# Altium schematic sheet Vezerlo.SchDoc: LED Matrix
size A4; Author: Bencsik Dániel Zoltán; Organization: BME-AUT; DocumentNumber: 3; Revision: A7; SheetNumber: 3; SheetTotal: 4
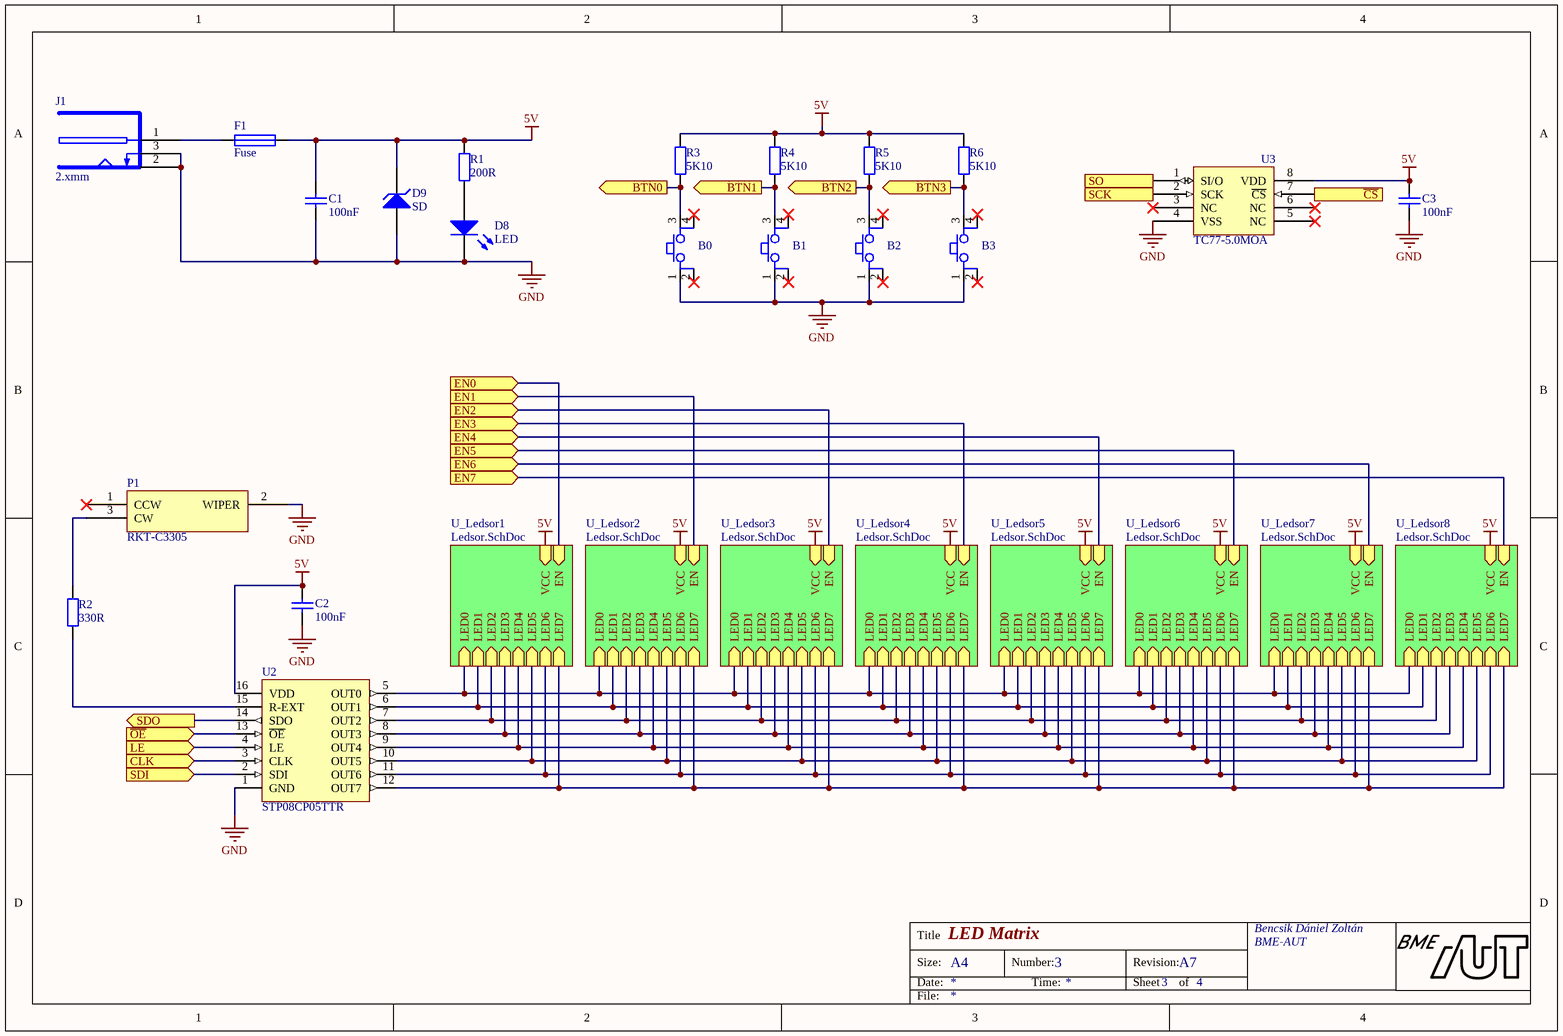
[diagram p0: Vezerlo.SchDoc]

## Parts
B0  Button  [FP_BTN_SMD]  (value not drawn)
B1  Button  [FP_BTN_SMD]  (value not drawn)
B2  Button  [FP_BTN_SMD]  (value not drawn)
B3  Button  [FP_BTN_SMD]  (value not drawn)
C1  100nF  [FP_0603_CAP_080]
C2  100nF  [FP_0603_CAP_080]
C3  100nF  [FP_0603_CAP_080]
D8  LED  [HF_FP_0805_LED_BLUE&RED_2]
D9  SD  [FP_SMA]
F1  Fuse  [FP_MULTIFUSE]
J1  2.xmm  [FP_DC_TAP_ANYA]
P1  RKT-C3305  [HF_POT]
R1  200R  [HF_FP_0603_RES]
R2  330R  [HF_FP_0603_RES]
R3  5K10  [HF_FP_0603_RES]
R4  5K10  [HF_FP_0603_RES]
R5  5K10  [HF_FP_0603_RES]
R6  5K10  [HF_FP_0603_RES]
U2  STP08CP05TTR  [TSOP65P640X120-16M]
U3  TC77-5.0MOA  [HF_SOIC127P599X175-8N]

## Sub-sheets
U_Ledsor1 = Ledsor.SchDoc: LED0 (in), LED1 (in), LED2 (in), LED3 (in), LED4 (in), LED5 (in), LED6 (in), LED7 (in), EN (in), VCC (in)
U_Ledsor2 = Ledsor.SchDoc: LED0 (in), LED1 (in), LED2 (in), LED3 (in), LED4 (in), LED5 (in), LED6 (in), LED7 (in), EN (in), VCC (in)
U_Ledsor3 = Ledsor.SchDoc: LED0 (in), LED1 (in), LED2 (in), LED3 (in), LED4 (in), LED5 (in), LED6 (in), LED7 (in), EN (in), VCC (in)
U_Ledsor4 = Ledsor.SchDoc: LED0 (in), LED1 (in), LED2 (in), LED3 (in), LED4 (in), LED5 (in), LED6 (in), LED7 (in), EN (in), VCC (in)
U_Ledsor5 = Ledsor.SchDoc: LED0 (in), LED1 (in), LED2 (in), LED3 (in), LED4 (in), LED5 (in), LED6 (in), LED7 (in), EN (in), VCC (in)
U_Ledsor6 = Ledsor.SchDoc: LED0 (in), LED1 (in), LED2 (in), LED3 (in), LED4 (in), LED5 (in), LED6 (in), LED7 (in), EN (in), VCC (in)
U_Ledsor7 = Ledsor.SchDoc: LED0 (in), LED1 (in), LED2 (in), LED3 (in), LED4 (in), LED5 (in), LED6 (in), LED7 (in), EN (in), VCC (in)
U_Ledsor8 = Ledsor.SchDoc: LED0 (in), LED1 (in), LED2 (in), LED3 (in), LED4 (in), LED5 (in), LED6 (in), LED7 (in), EN (in), VCC (in)

## Ports
BTN0 (out), BTN1 (out), BTN2 (out), BTN3 (out), CLK (in), EN0 (in), EN1 (in), EN2 (in), EN3 (in), EN4 (in), EN5 (in), EN6 (in), EN7 (in), LE (in), SCK (in), SDI (in), SDO (out), SO (out), ~{CS} (in), ~{OE} (in)

## Nets
5V: C1.2 C2.2 C3.2 D9.K F1.2 R1.2 R3.2 R4.2 R5.2 R6.2 U2.16(VDD) U3.8(VDD) ; sheet U_Ledsor1/VCC, sheet U_Ledsor2/VCC, sheet U_Ledsor3/VCC, sheet U_Ledsor4/VCC, sheet U_Ledsor5/VCC, sheet U_Ledsor6/VCC, sheet U_Ledsor7/VCC, sheet U_Ledsor8/VCC
GND: B0.1 B1.1 B2.1 B3.1 C1.1 C2.1 C3.1 D8.K D9.A J1.2(SLEEVE) J1.3(BREAK) P1.2(WIPER) U2.1(GND) U3.4(VSS)
BTN0: B0.3 R3.1 ; port BTN0
BTN1: B1.3 R4.1 ; port BTN1
BTN2: B2.3 R5.1 ; port BTN2
BTN3: B3.3 R6.1 ; port BTN3
~{CS}: U3.7(~{CS}) ; port ~{CS}
CLK: U2.3(CLK) ; port CLK
EN0: port EN0, sheet U_Ledsor1/EN
EN1: port EN1, sheet U_Ledsor2/EN
EN2: port EN2, sheet U_Ledsor3/EN
EN3: port EN3, sheet U_Ledsor4/EN
EN4: port EN4, sheet U_Ledsor5/EN
EN5: port EN5, sheet U_Ledsor6/EN
EN6: port EN6, sheet U_Ledsor7/EN
EN7: port EN7, sheet U_Ledsor8/EN
LE: U2.4(LE) ; port LE
~{OE}: U2.13(~{OE}) ; port ~{OE}
SCK: U3.2(SCK) ; port SCK
SDI: U2.2(SDI) ; port SDI
SDO: U2.14(SDO) ; port SDO
SO: U3.1(SI/O) ; port SO
NetD8_A: D8.A R1.1
NetF1_1: F1.1 J1.1(PIN)
NetP1_3: P1.3(CW) R2.2
NetR2_1: R2.1 U2.15(R-EXT)
NetU2_5: U2.5(OUT0) ; sheet U_Ledsor1/LED0, sheet U_Ledsor2/LED0, sheet U_Ledsor3/LED0, sheet U_Ledsor4/LED0, sheet U_Ledsor5/LED0, sheet U_Ledsor6/LED0, sheet U_Ledsor7/LED0, sheet U_Ledsor8/LED0
NetU2_6: U2.6(OUT1) ; sheet U_Ledsor1/LED1, sheet U_Ledsor2/LED1, sheet U_Ledsor3/LED1, sheet U_Ledsor4/LED1, sheet U_Ledsor5/LED1, sheet U_Ledsor6/LED1, sheet U_Ledsor7/LED1, sheet U_Ledsor8/LED1
NetU2_7: U2.7(OUT2) ; sheet U_Ledsor1/LED2, sheet U_Ledsor2/LED2, sheet U_Ledsor3/LED2, sheet U_Ledsor4/LED2, sheet U_Ledsor5/LED2, sheet U_Ledsor6/LED2, sheet U_Ledsor7/LED2, sheet U_Ledsor8/LED2
NetU2_8: U2.8(OUT3) ; sheet U_Ledsor1/LED3, sheet U_Ledsor2/LED3, sheet U_Ledsor3/LED3, sheet U_Ledsor4/LED3, sheet U_Ledsor5/LED3, sheet U_Ledsor6/LED3, sheet U_Ledsor7/LED3, sheet U_Ledsor8/LED3
NetU2_9: U2.9(OUT4) ; sheet U_Ledsor1/LED4, sheet U_Ledsor2/LED4, sheet U_Ledsor3/LED4, sheet U_Ledsor4/LED4, sheet U_Ledsor5/LED4, sheet U_Ledsor6/LED4, sheet U_Ledsor7/LED4, sheet U_Ledsor8/LED4
NetU2_10: U2.10(OUT5) ; sheet U_Ledsor1/LED5, sheet U_Ledsor2/LED5, sheet U_Ledsor3/LED5, sheet U_Ledsor4/LED5, sheet U_Ledsor5/LED5, sheet U_Ledsor6/LED5, sheet U_Ledsor7/LED5, sheet U_Ledsor8/LED5
NetU2_11: U2.11(OUT6) ; sheet U_Ledsor1/LED6, sheet U_Ledsor2/LED6, sheet U_Ledsor3/LED6, sheet U_Ledsor4/LED6, sheet U_Ledsor5/LED6, sheet U_Ledsor6/LED6, sheet U_Ledsor7/LED6, sheet U_Ledsor8/LED6
NetU2_12: U2.12(OUT7) ; sheet U_Ledsor1/LED7, sheet U_Ledsor2/LED7, sheet U_Ledsor3/LED7, sheet U_Ledsor4/LED7, sheet U_Ledsor5/LED7, sheet U_Ledsor6/LED7, sheet U_Ledsor7/LED7, sheet U_Ledsor8/LED7

Not connected (* = marked no-connect by the designer): B0 2* 4*; B1 2* 4*; B2 2* 4*; B3 2* 4*; P1 1(CCW)*; U3 3(NC)* 5(NC)* 6(NC)*

## Notes on the sheet
- Title
- Size:
- Date:
- A4
- Number:
- Time:
- Revision:
- Sheet
- of
- File:

## Library data of the parts
B0-B3 = Button 4P: Push button; Name: TACT 6x 6 4P SPST 2 FSM4JSMA (TYC) 50mA 12VDC SMD H=5mm 160g BLACK B. 4-1437565-1; Reference: 45-05-43; Supplier: Lomex
C1-C3 = CAP: Capacitor; Name: 100nF 0603 10% 50V X7R CC0603KPX7R9BB104 (YAG); Supplier: Lomex; Reference: 82-12-71; Value: 100nF
D8 = LED: Typical RED GaAs LED; Name: 2012 RED 631nm 80mcd FYLS-0805URC (FYL) W.CLEAR 2x1.2x0.8mm 0805 130°; Supplier: Lomex; Reference: 95-02-74
D9 = ZENER: Zener Diode; U_Z: 24; Reference: 1815679; Name: SMAJ5.0A-E3/5A; Supplier: Farnell
F1 = Fuse: Name: 1.25A 15V 1812L125/16DR POLYFUSE SMD 1812 (LFS) ˝LF125-16˝; Reference: 44-04-71; Supplier: Lomex
J1 = DC_TAP_ANYA: 2.xmm DC HEBA25 TÁPFESZÜLTSÉG ALJZAT ZÁRT, NYÁKBA 90°; Name: TÁP DC ANYA 5.5/2.1/9.5mm DCS-5521-5; Supplier: Lomex; Reference: 43-07-67
P1 = RKT-C3305: TRIMMER POTENTIOMETER-3mm SMD; Name: 10K0 3305-103R (KIC) 3x3.5mm CERMET; Supplier: Lomex; Reference: 90-00-58
R1 = RES: Resistor; Name: 200R 0603 5% RK73B1JTTD201J 0.1W (KOA) Ł; Supplier: Lomex; Reference: 81-04-08; Value: 200R
R2 = RES: Resistor; Name: 330R 0603 5% WR06X331JTL 0.1W (WAL); Supplier: Lomex; Reference: 81-17-48; Value: 330R
R3-R6 = RES: Resistor; Name: 5K10 0603 5% WR06X512JTL 0.1W (WAL); Supplier: Lomex; Reference: 81-28-96; Value: 5K10
U2 = STP08CP05TTR: Low voltage, low current power 8-bit shift register; Supplier: Tanszék; Reference: STP08CP05TTR; Name: STP08CP05TTR
U3 = TC77-5.0MOA: Thermal Sensor with SPI Interface; Reference: 1439514; Supplier: Farnell; Name: TC77-5.0MOA